# EAGLE design Organ Pedal Module v0.1 (EAGLE 8.4.0)
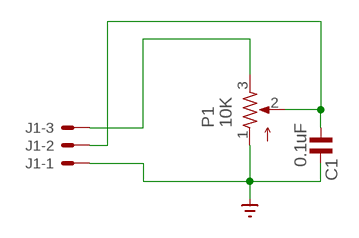
[diagram p0: schematic, sheet 1]

## Parts
C1  0.1uF  C_0805MP  [C0805MP]
J1  22-05-7038-03  [7395-03]
P1  10K  PTA6043  [PTA6043]

## Nets
GND: C1.2 J1.1 P1.1
N$1: J1.3 P1.3
N$2: C1.1 J1.2 P1.2

## Library data of the parts
C1 = rc-master-smd:C_: NON-POLARIZED CAP
J1 = con-molex:22-?-03: CONNECTOR wire to board 2.54 mm (.1 inch) pitch header
P1 = jdc:PTA6043: Bourns 1/4W Through Hole Slide Potentiometer Top, Standard, 60mm Adjustment Type http://www.bourns.com/docs/Product-Datasheets/pta.pdf

## Board
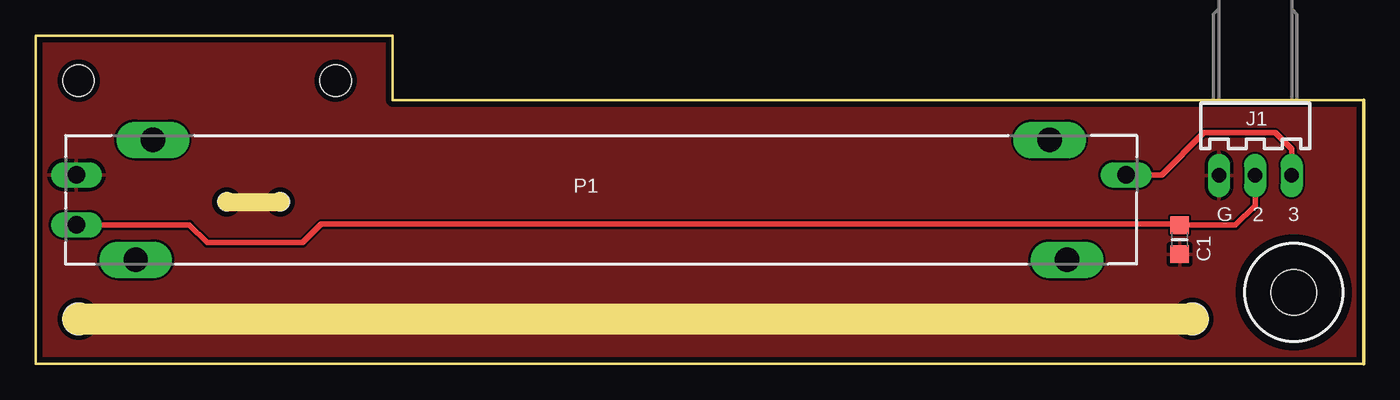
[diagram p1: board, top side]
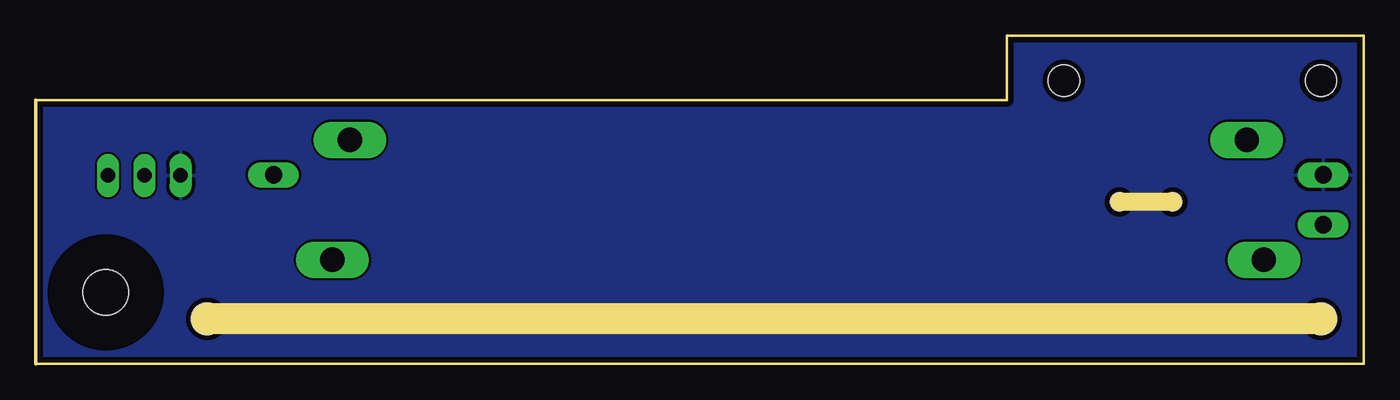
[diagram p2: board, bottom side, seen from below]

Size 93 x 23 mm. Coordinates in mm from the lower left corner, seen from the top.
Outline: 0,0 93,0 93,18.5 25,18.5 25,23 0,23 0,0
Copper layers (1*16): Top 0.0356mm / dielectric 1.5011mm / Bottom 0.0356mm
Design rules "LaenPCBOrder": minimum track width 6mil, minimum drill 13mil, track to track 6mil, track to pad 6mil, pad to pad 6mil, via to via 6mil, smd to smd 6mil, copper to edge 15mil, drill to drill 6mil, minimum pad ring 7mil, minimum via ring 7mil, stop-mask expansion 4mil, vias tented up to drill 0mil, thermal gap 10mil
Holes 2.18 mm at 3,19.85 21,19.85 3,3.15 81,3.15
Holes 1.27 mm at 13.38,11.35 17.11,11.35
Milling: 2 lines

### Footprints (pad centres in the part's own frame; a part is rotated, then mirrored left to right if it is on the bottom)
C0805MP = smd 1.2 x 1.3: 1 -1.016,0; 2 1.016,0
7395-03 = drill 1.016 long: 1 2.54,0; 2 0,0; 3 -2.54,0
PTA6043 = drill 1.2 long: 1 -36.75,1.75; 2 -36.75,-1.75; 3 36.75,1.75 | drill 1.7 long: P$1 -31.4,4.2; P$2 -32.6,-4.2; P$3 31.4,4.2; P$4 32.62,-4.2
3,2 = hole 3.2: 0,0

### Placement (x,y rotation side)
C1  80.1,8.7 270 top
J1  85.4,13.2 180 top
P1  39.6,11.5 0 top
U$1  [3,2]  88.1,5 0 top

### Tracks (layer width: path | path; a pad name or v marks a point on that pad's centre or on a via)
GND
  pour Bottom: -1,-1 94,-1 94,26 -1,26
  pour Top: -2,-2 95,-2 95,27 -2,27
N$1
  Top 0.381: P1.3 78.85,13.25 81.8,16.2 86.8,16.2 87.94,15.06 J1.3
N$2
  Top 0.381: C1.1 80.07,9.75 | C1.1 84.02,9.72 85.4,11.1 J1.2 | P1.2 10.75,9.75 12,8.5 18.7,8.5 20,9.8 80.02,9.8 C1.1

### Text on the board
tNames: G | 2 | 3